# Altium schematic sheet I2C_Board.schdoc
size 211 x 110 mm
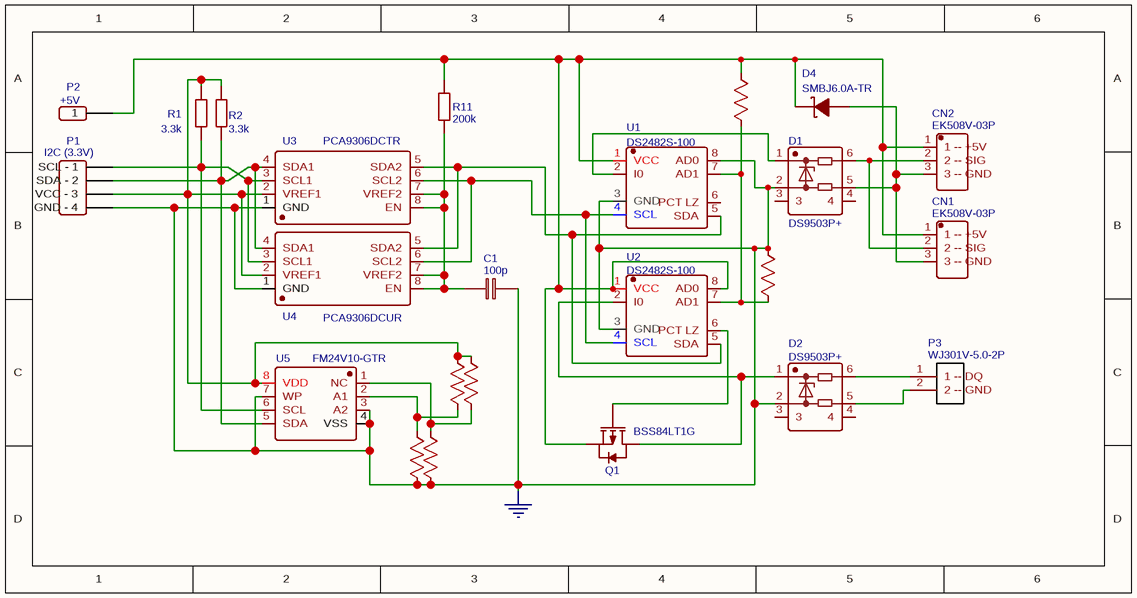
[diagram p0: I2C_Board.schdoc]

## Parts
A0  0  [0603]  (value not drawn)
A1  0  [0603]  (value not drawn)
A_0  0  [0603]  (value not drawn)
A_1  0  [0603]  (value not drawn)
AD1  0  [0603]  (value not drawn)
AD_1  0  [0603]  (value not drawn)
C1  100p  [0805]
CN1  EK508V-03P  [WJ301V-5.00-3P]
CN2  EK508V-03P  [WJ301V-5.00-3P]
D1  DS9503P+  [TSOC-6]
D2  DS9503P+  [TSOC-6]
D4  SMBJ6.0A-TR  [SMB(DO-214AA)]
P1  I2C (3.3V)  [HDR-4X1/2.54]
P2  +5V  [HDR-1X1/2.54]
P3  WJ301V-5.0-2P  [WJ301V-5.00-2P]
Q1  BSS84LT1G  [SOT-23(SOT-23-3)]
R1  3.3k  [0805]
R2  3.3k  [0805]
R11  200k  [0805]
U1  DS2482S-100  [SOIC-8_150MIL]
U2  DS2482S-100  [SOIC-8_150MIL]
U3  PCA9306DCTR  [TSSOP8_3 THIN PAD]
U4  PCA9306DCUR  [VSSOP-8_2X2.3X05P]
U5  FM24V10-GTR  [SOIC-8_150MIL]

## Nets
GND: A_0.1 A_1.1 AD_1.2 C1.2 D1.2(P$2) D2.2(P$2) P1.4(GND_-_4) U1.3(GND) U1.8(AD0) U2.3(GND) U3.1(GND) U4.1(GND) U5.3(A2) U5.4(VSS) U5.7(WP)
NetA0_1: A0.1 A_0.2 U5.1(NC)
NetA0_2: A0.2 A1.2 P1.3(VCC_-_3) R1.2 R2.2 U3.2(VREF1) U4.2(VREF1) U5.8(VDD)
NetA1_1: A1.1 A_1.2 U5.2(A1)
NetAD1_1: AD1.1 AD_1.1 U1.7(AD1) U2.7(AD1)
NetAD1_2: AD1.2 CN1.1(1_--_+5V) CN2.1(1_--_+5V) D4.2(K) P2.1 Q1.2(S) R11.1 U1.1(VCC) U2.1(VCC) U2.8(AD0)
NetC1_1: C1.1 R11.2 U3.7(VREF2) U3.8(EN) U4.7(VREF2) U4.8(EN)
NetCN1_2: CN1.2(2_--_SIG) CN2.2(2_--_SIG) D1.6(P$4)
NetCN1_3: CN1.3(3_--_GND) CN2.3(3_--_GND) D1.5(P$3) D4.1(A)
NetD1_1: D1.1(P$1) U1.2(I0)
NetD2_1: D2.1(P$1) Q1.3(D) U2.2(I0)
NetD2_5: D2.5(P$3) P3.2(2_--_GND)
NetD2_6: D2.6(P$4) P3.1(1_--_DQ)
NetP1_1: P1.1(SCL_-_1) R1.1 U3.3(SCL1) U4.3(SCL1) U5.6(SCL)
NetP1_2: P1.2(SDA_-_2) R2.1 U3.4(SDA1) U4.4(SDA1) U5.5(SDA)
NetQ1_1: Q1.1(G) U2.6(PCT_LZ)
NetU1_4: U1.4(SCL) U2.4(SCL) U3.6(SCL2) U4.6(SCL2)
NetU1_5: U1.5(SDA) U2.5(SDA) U3.5(SDA2) U4.5(SDA2)

Not connected (* = marked no-connect by the designer): D1 3 4; D2 3 4; U1 6(PCT_LZ)

## Library data of the parts
A0 A1 A_0 A_1 AD1 AD_1 = (no symbol name): nameAlias: Value(Ω); BOM_Manufacturer Part: ?; spicePre: R; spiceSymbolName: Res_0603(1/10W)_US
C1 = (no symbol name): nameAlias: Value(F); BOM_Mounted: Yes; BOM_Manufacturer Part: ?; spicePre: C; spiceSymbolName: Capacitor
CN1 CN2 = (no symbol name): BOM_Manufacturer: Dinkle; BOM_Supplier: LCSC; BOM_Manufacturer Part: EK508V-03P; BOM_LCSC: C99393; spicePre: C
D1 D2 = (no symbol name): BOM_Manufacturer: MAXIM; Contributor: LCSC; BOM_Supplier: LCSC; BOM_LCSC: C124131; BOM_Manufacturer Part: DS9503P+; spicePre: D
D4 = (no symbol name): BOM_Manufacturer: STMicroelectronics; Contributor: LCSC; BOM_Supplier: LCSC; BOM_LCSC: C130396; BOM_Manufacturer Part: SMBJ6.0A-TR; spicePre: D
P1 = (no symbol name): BOM_Manufacturer: ReliaPro; BOM_Manufacturer Part: Headers??Pins 1*4P; BOM_Supplier: LCSC; image: http://image.lceda.cn/szlcsc/C59481.jpg; spicePre: P
P2 = (no symbol name): BOM_Manufacturer: ReliaPro; BOM_Manufacturer Part: Header 1*1P; BOM_Supplier: LCSC; BOM_LCSC: C81276; spicePre: P
P3 = (no symbol name): BOM_Manufacturer: ReliaPro; BOM_Supplier: LCSC; BOM_Manufacturer Part: WJ301V-5.0-2P; BOM_LCSC: C8475; image: //image.lceda.cn/szlcsc/C8475.jpg; spicePre: P
Q1 = (no symbol name): BOM_Manufacturer: ON; BOM_Supplier: LCSC; BOM_Manufacturer Part: BSS84LT1G; BOM_LCSC: C82079; image: //image.lceda.cn/szlcsc/C82079.jpg; spicePre: Q
R1 R2 R11 = (no symbol name): nameAlias: Value(Ω); BOM_Mounted: Yes; BOM_Manufacturer Part: ?; spicePre: R; spiceSymbolName: Resistor
U1 U2 = (no symbol name): BOM_Manufacturer: MAXIM; BOM_Manufacturer Part: DS2482S-100+T&R; Contributor: LCSC; BOM_Supplier: LCSC; BOM_LCSC: C143306; spicePre: U
U4 = (no symbol name): BOM_Manufacturer: TI; BOM_Supplier: LCSC; BOM_Manufacturer Part: PCA9306DCUR; BOM_LCSC: C33196; image: //image.lceda.cn/szlcsc/C33196.jpg; spicePre: U
U5 = (no symbol name): BOM_Manufacturer: RAMTRON; BOM_Supplier: LCSC; BOM_Manufacturer Part: FM24V10-GTR; BOM_LCSC: C52773; spicePre: U
U3 = (no symbol name): spicePre: X; BOM_Manufacturer Part: ?